# EAGLE design DS2481-100-Test1 (EAGLE 7.3.0)
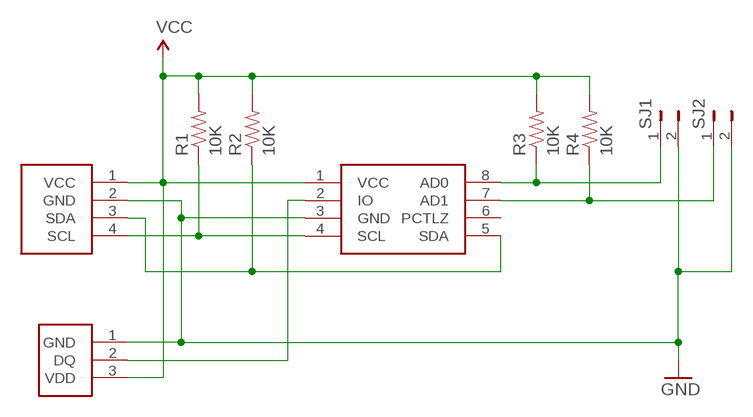
[diagram p0: schematic, sheet 1]

## Parts
R1  10K  RES-10K-06030603  [0603-RES]
R2  10K  RES-10K-06030603  [0603-RES]
R3  10K  RES-10K-06030603  [0603-RES]
R4  10K  RES-10K-06030603  [0603-RES]
SJ1  JUMPER-PTH-2-NO  [PTH-JUMPER-2-NO_NO_SILK]
SJ2  JUMPER-PTH-2-NO  [PTH-JUMPER-2-NO_NO_SILK]
U$1  HEADER-I2C-PWR  [HEADER-I2C-PWR]
U$2  DS2482-100  [8-SOIC-MAXIM]
U$3  TERMBLOCK-1WIRE  [TERMBLOCK-1WIRE]

## Nets
GND: SJ1.2 SJ2.2 U$1.2(GND) U$2.3(GND) U$3.1(GND)
N$2: U$2.2(IO) U$3.2(DQ)
N$3: R1.1 U$1.4(SCL) U$2.4(SCL)
N$4: R2.1 U$1.3(SDA) U$2.5(SDA)
N$7: R3.1 SJ1.1 U$2.8(AD0)
N$8: R4.1 SJ2.1 U$2.7(AD1)
VCC: R1.2 R2.2 R3.2 R4.2 U$1.1(VCC) U$2.1(VCC) U$3.3(VDD)
Unconnected: U$2.6(PCTLZ)

## Library data of the parts
R1-R4 = rickk2:RES-10K-0603: RES SMD 10K OHM 5% 1/4W 0603 $ 0.10 https://www.digikey.com/product-detail/en/panasonic-electronic-components/ERJ-PA3J103V/P10KBZCT-ND/5036237
SJ1 SJ2 = rickk2:JUMPER-PTH-2-NO
U$1 = rickk2:HEADER-I2C-PWR
U$2 = rickk2:DS2482-100: IC BRIDGE I2C TO 1-WIRE 8-SOIC $1.54 1-Wire® Bridge, 1-Wire® to I²C I²C Interface 8-SOIC https://www.digikey.com/product-detail/en/maxim-integrated/DS2482S-100-/DS2482S-100--ND/1197435
U$3 = rickk2:TERMBLOCK-1WIRE: TERM BLOCK 3.5MM VERT 3POS PCB $1.00 3 Position Wire to Board Terminal Block Horizontal with Board 0.138" (3.50mm) Through Hole 10A 16-26 AWG Top screw, vertical, blue https://www.digikey.com/product-detail/en/on-shore-technology-inc/OSTTE030161/ED2636-ND/614585

## Board
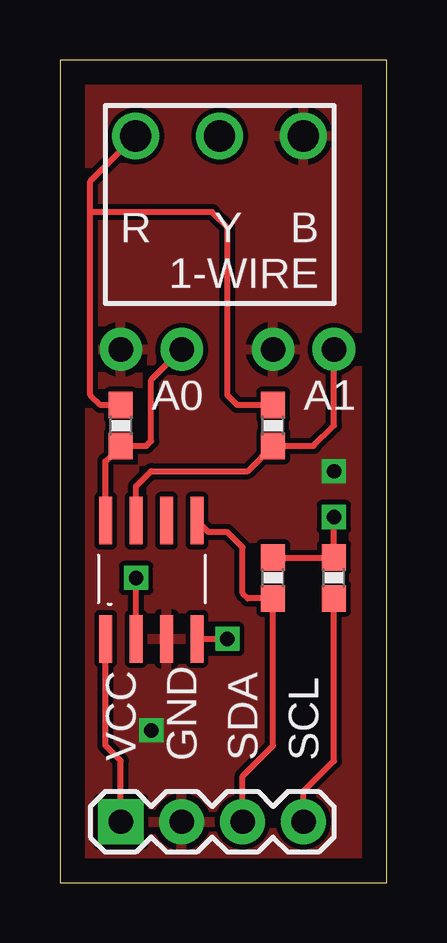
[diagram p1: board, top side]
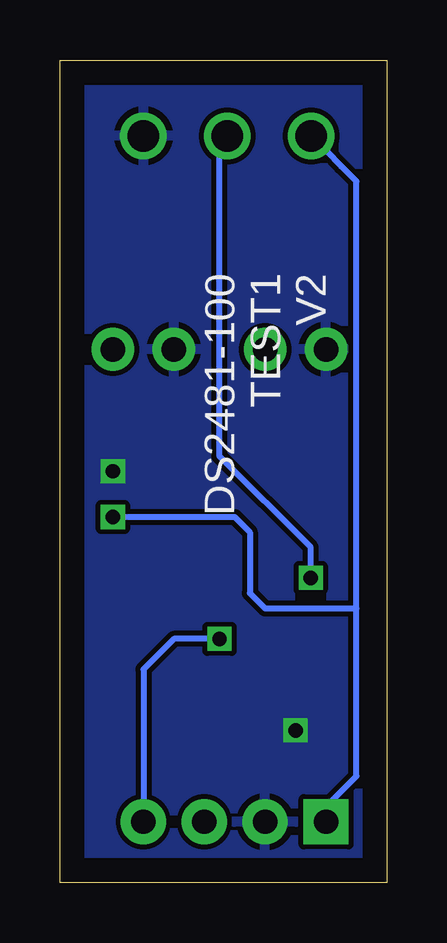
[diagram p2: board, bottom side, seen from below]

Size 13.64 x 34.28 mm. Coordinates in mm from the lower left corner, seen from the top.
Outline: 0,0 13.64,0 13.64,34.28 0,34.28 0,0
Copper layers (1*16): Top 0.035mm / dielectric 1.5mm / Bottom 0.035mm
Design rules "default": minimum track width 10mil, minimum drill 24mil, track to track 8mil, track to pad 8mil, pad to pad 8mil, via to via 8mil, smd to smd 8mil, copper to edge 40mil, drill to drill 8mil, minimum pad ring 10mil, minimum via ring 8mil, stop-mask expansion 4mil, vias tented up to drill 0mil, thermal gap 10mil

### Footprints (pad centres in the part's own frame; a part is rotated, then mirrored left to right if it is on the bottom)
0603-RES = smd 1.1 x 1: 1 -0.85,0; 2 0.85,0
PTH-JUMPER-2-NO_NO_SILK = drill 1.016 pad 1.778: 1 -1.27,0; 2 1.27,0
HEADER-I2C-PWR = drill 1.016 pad 1.88 square: 1 0,0 | drill 1.016 pad 1.88: 2 2.54,0; 3 5.08,0; 4 7.62,0
8-SOIC-MAXIM = smd 0.53 x 1.98: 1 0,0; 2 1.27,0; 3 2.54,0; 4 3.81,0; 5 3.81,4.93; 6 2.54,4.93; 7 1.27,4.93; 8 0,4.93
TERMBLOCK-1WIRE = drill 1.3: 1 0,0; 2 3.5,0; 3 7,0

### Placement (x,y rotation side)
R1  11.43,12.7 90 top
R2  8.89,12.7 90 top
R3  2.54,19.05 90 top
R4  8.89,19.05 90 top
SJ1  3.81,22.23 180 top
SJ2  10.16,22.23 180 top
U$1  2.54,2.54 0 top
U$2  1.91,10.16 0 top
U$3  10.16,31.11 180 top

### Tracks (layer width: path | path; a pad name or v marks a point on that pad's centre or on a via)
GND  (via drill 0.6)
  other vias: 3.81,6.35 11.43,17.14
  pour Bottom: 0,0 0,34.29 13.97,34.29 13.97,0
  pour Top: 0,34.29 13.97,34.29 13.97,0 0,0
N$2  (via drill 0.6)
  Top 0.254: U$2.2 v3.17,12.7
  Bottom 0.254: v3.17,12.7 3.17,13.97 6.99,17.78 6.99,30.79 U$3.2
N$3  (via drill 0.6)
  Top 0.254: U$1.4 10.16,3.81 11.43,5.08 R1.1 | U$2.4 v6.99,10.16
  Bottom 0.254: v6.99,10.16 8.89,10.16 10.16,8.89 U$1.4
N$4
  Top 0.254: U$1.3 7.62,4.45 8.89,5.71 R2.1 7.83,11.85 7.62,12.06 7.62,13.97 6.99,14.61 6.2,14.61 U$2.5
N$7
  Top 0.254: U$2.8 1.91,17.57 R3.1 3.6,18.2 3.81,18.41 3.81,20.95 SJ1.1
N$8
  Top 0.254: U$2.7 3.17,16.51 3.81,17.14 7.83,17.14 R4.1 10.58,18.2 11.43,19.05 SJ2.1
VCC  (via drill 0.6)
  Top 0.254: U$1.1 2.54,5.08 1.91,5.71 U$2.1 | R2.2 R1.2 v11.43,15.24 | 1.27,27.94 6.35,27.94 6.99,27.3 6.99,20.32 7.41,19.9 R4.2 | R3.2 1.69,19.9 1.27,20.32 1.27,27.94 | 1.27,27.94 1.27,29.23 U$3.3
  Bottom 0.254: U$1.1 2.54,3.17 1.27,4.45 1.27,11.43 | v11.43,15.24 6.35,15.24 5.71,14.61 5.71,12.06 5.08,11.43 1.27,11.43 | 1.27,11.43 1.27,29.21 | 1.27,29.21 1.91,29.84 | 1.27,29.21 1.27,29.23 U$3.3

### Text on the board
tPlace: A0 | A1
bPlace: DS2481-100 / TEST1 / V2